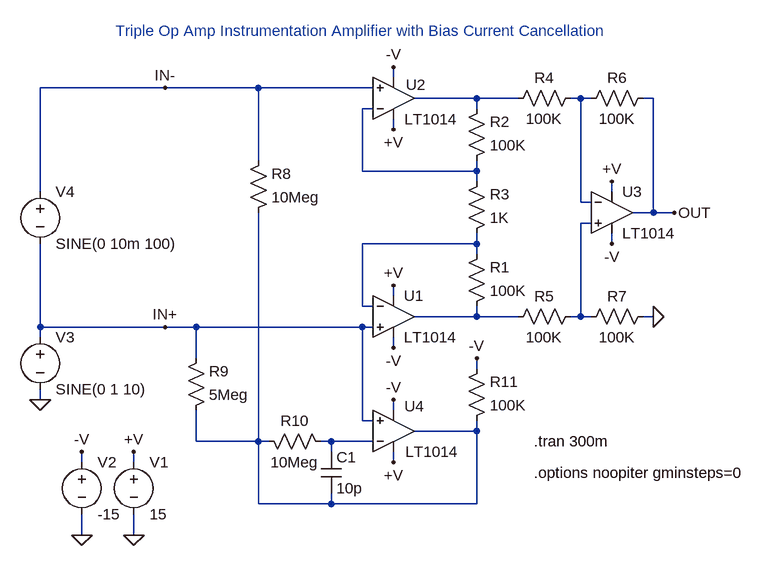
[diagram p0: schematic 1014.asc]
1014.asc, the LTspice schematic file:
Version 4
SHEET 1 896 680
WIRE 144 -144 144 -160
WIRE -208 -128 -400 -128
WIRE -64 -128 -208 -128
WIRE 112 -128 -64 -128
WIRE 272 -112 176 -112
WIRE 336 -112 272 -112
WIRE 432 -112 416 -112
WIRE 448 -112 432 -112
WIRE 544 -112 528 -112
WIRE 112 -96 96 -96
WIRE 272 -96 272 -112
WIRE 144 -64 144 -80
WIRE -64 -16 -64 -128
WIRE 96 0 96 -96
WIRE 272 0 272 -16
WIRE 272 0 96 0
WIRE 272 16 272 0
WIRE -400 32 -400 -128
WIRE 480 32 480 16
WIRE 432 48 432 -112
WIRE 448 48 432 48
WIRE 544 64 544 -112
WIRE 544 64 512 64
WIRE 576 64 544 64
WIRE 448 80 432 80
WIRE 272 112 272 96
WIRE 272 112 96 112
WIRE 480 112 480 96
WIRE 272 128 272 112
WIRE 144 192 144 176
WIRE 96 208 96 112
WIRE 112 208 96 208
WIRE 272 224 272 208
WIRE 272 224 176 224
WIRE 336 224 272 224
WIRE 432 224 432 80
WIRE 432 224 416 224
WIRE 448 224 432 224
WIRE 544 224 528 224
WIRE -400 240 -400 112
WIRE -208 240 -400 240
WIRE -160 240 -208 240
WIRE 96 240 -160 240
WIRE 112 240 96 240
WIRE -400 256 -400 240
WIRE 144 272 144 256
WIRE -160 288 -160 240
WIRE 272 304 272 288
WIRE -400 352 -400 336
WIRE 144 368 144 352
WIRE 96 384 96 240
WIRE 112 384 96 384
WIRE 272 400 272 384
WIRE 272 400 176 400
WIRE -160 416 -160 368
WIRE -64 416 -64 64
WIRE -64 416 -160 416
WIRE -48 416 -64 416
WIRE 48 416 32 416
WIRE 112 416 48 416
WIRE 48 432 48 416
WIRE -336 448 -336 432
WIRE -256 448 -256 432
WIRE 144 448 144 432
WIRE -64 512 -64 416
WIRE 48 512 48 496
WIRE 48 512 -64 512
WIRE 272 512 272 400
WIRE 272 512 48 512
WIRE -336 560 -336 528
WIRE -256 560 -256 528
FLAG -256 560 0
FLAG 144 176 +V
FLAG -256 432 +V
FLAG 144 272 -V
FLAG -336 560 0
FLAG -336 432 -V
FLAG -400 352 0
FLAG 144 -64 +V
FLAG 144 -160 -V
FLAG 480 16 +V
FLAG 480 112 -V
FLAG 544 224 0
FLAG 144 448 +V
FLAG 144 352 -V
FLAG 272 288 -V
FLAG 576 64 OUT
FLAG -208 -128 IN-
FLAG -208 240 IN+
SYMBOL voltage -256 432 R0
SYMATTR InstName V1
SYMATTR Value 15
SYMBOL voltage -336 432 R0
SYMATTR InstName V2
SYMATTR Value -15
SYMBOL res 256 224 M180
WINDOW 0 36 76 Left 0
WINDOW 3 36 40 Left 0
SYMATTR InstName R1
SYMATTR Value 100K
SYMBOL res 256 0 M180
WINDOW 0 36 76 Left 0
WINDOW 3 36 40 Left 0
SYMATTR InstName R2
SYMATTR Value 100K
SYMBOL voltage -400 240 R0
SYMATTR InstName V3
SYMATTR Value SINE(0 1 10)
SYMBOL opamps\\LT1014 144 160 R0
SYMATTR InstName U1
SYMBOL opamps\\LT1014 144 -48 M180
WINDOW 0 19 85 Left 0
WINDOW 3 17 32 Left 0
SYMATTR InstName U2
SYMBOL res 256 112 M180
WINDOW 0 36 76 Left 0
WINDOW 3 36 40 Left 0
SYMATTR InstName R3
SYMATTR Value 1K
SYMBOL opamps\\LT1014 480 0 R0
SYMATTR InstName U3
SYMBOL res 432 -128 R90
WINDOW 0 0 56 VBottom 0
WINDOW 3 32 56 VTop 0
SYMATTR InstName R4
SYMATTR Value 100K
SYMBOL res 432 208 R90
WINDOW 0 0 56 VBottom 0
WINDOW 3 32 56 VTop 0
SYMATTR InstName R5
SYMATTR Value 100K
SYMBOL res 544 -128 R90
WINDOW 0 0 56 VBottom 0
WINDOW 3 32 56 VTop 0
SYMATTR InstName R6
SYMATTR Value 100K
SYMBOL res 544 208 R90
WINDOW 0 0 56 VBottom 0
WINDOW 3 32 56 VTop 0
SYMATTR InstName R7
SYMATTR Value 100K
SYMBOL voltage -400 16 R0
SYMATTR InstName V4
SYMATTR Value SINE(0 10m 100)
SYMBOL res -80 80 M180
WINDOW 0 36 76 Left 0
WINDOW 3 36 40 Left 0
SYMATTR InstName R8
SYMATTR Value 10Meg
SYMBOL res -176 384 M180
WINDOW 0 36 76 Left 0
WINDOW 3 36 40 Left 0
SYMATTR InstName R9
SYMATTR Value 5Meg
SYMBOL res -64 400 M90
WINDOW 0 0 56 VBottom 0
WINDOW 3 32 56 VTop 0
SYMATTR InstName R10
SYMATTR Value 10Meg
SYMBOL cap 32 432 R0
SYMATTR InstName C1
SYMATTR Value 10p
SYMBOL opamps\\LT1014 144 464 M180
WINDOW 0 17 102 Left 0
WINDOW 3 18 32 Left 0
SYMATTR InstName U4
SYMBOL res 256 400 M180
WINDOW 0 36 76 Left 0
WINDOW 3 36 40 Left 0
SYMATTR InstName R11
SYMATTR Value 100K
TEXT 360 416 Left 0 !.tran 300m
TEXT 96 -200 Bottom 0 ;Triple Op Amp Instrumentation Amplifier with Bias Current Cancellation
TEXT 360 464 Left 0 !.options noopiter gminsteps=0

The netlist it stands for:
* 1014.asc
V1 +V 0 15
V2 -V 0 -15
R1 N006 N005 100K
R2 N003 N001 100K
V3 IN+ 0 SINE(0 1 10)
XU1 IN+ N005 +V -V N006 LT1014  ; pins In+ In- V+ V- OUT
XU2 IN- N003 +V -V N001 LT1014  ; pins In+ In- V+ V- OUT
R3 N005 N003 1K
XU3 N004 N002 +V -V OUT LT1014  ; pins In+ In- V+ V- OUT
R4 N002 N001 100K
R5 N004 N006 100K
R6 OUT N002 100K
R7 0 N004 100K
V4 IN- IN+ SINE(0 10m 100)
R8 N007 IN- 10Meg
R9 N007 IN+ 5Meg
R10 N007 N008 10Meg
C1 N008 N007 10p
XU4 IN+ N008 +V -V N007 LT1014  ; pins In+ In- V+ V- OUT
R11 N007 -V 100K
.tran 300m
* Triple Op Amp Instrumentation Amplifier with Bias Current Cancellation
.options noopiter gminsteps=0
.backanno
.end